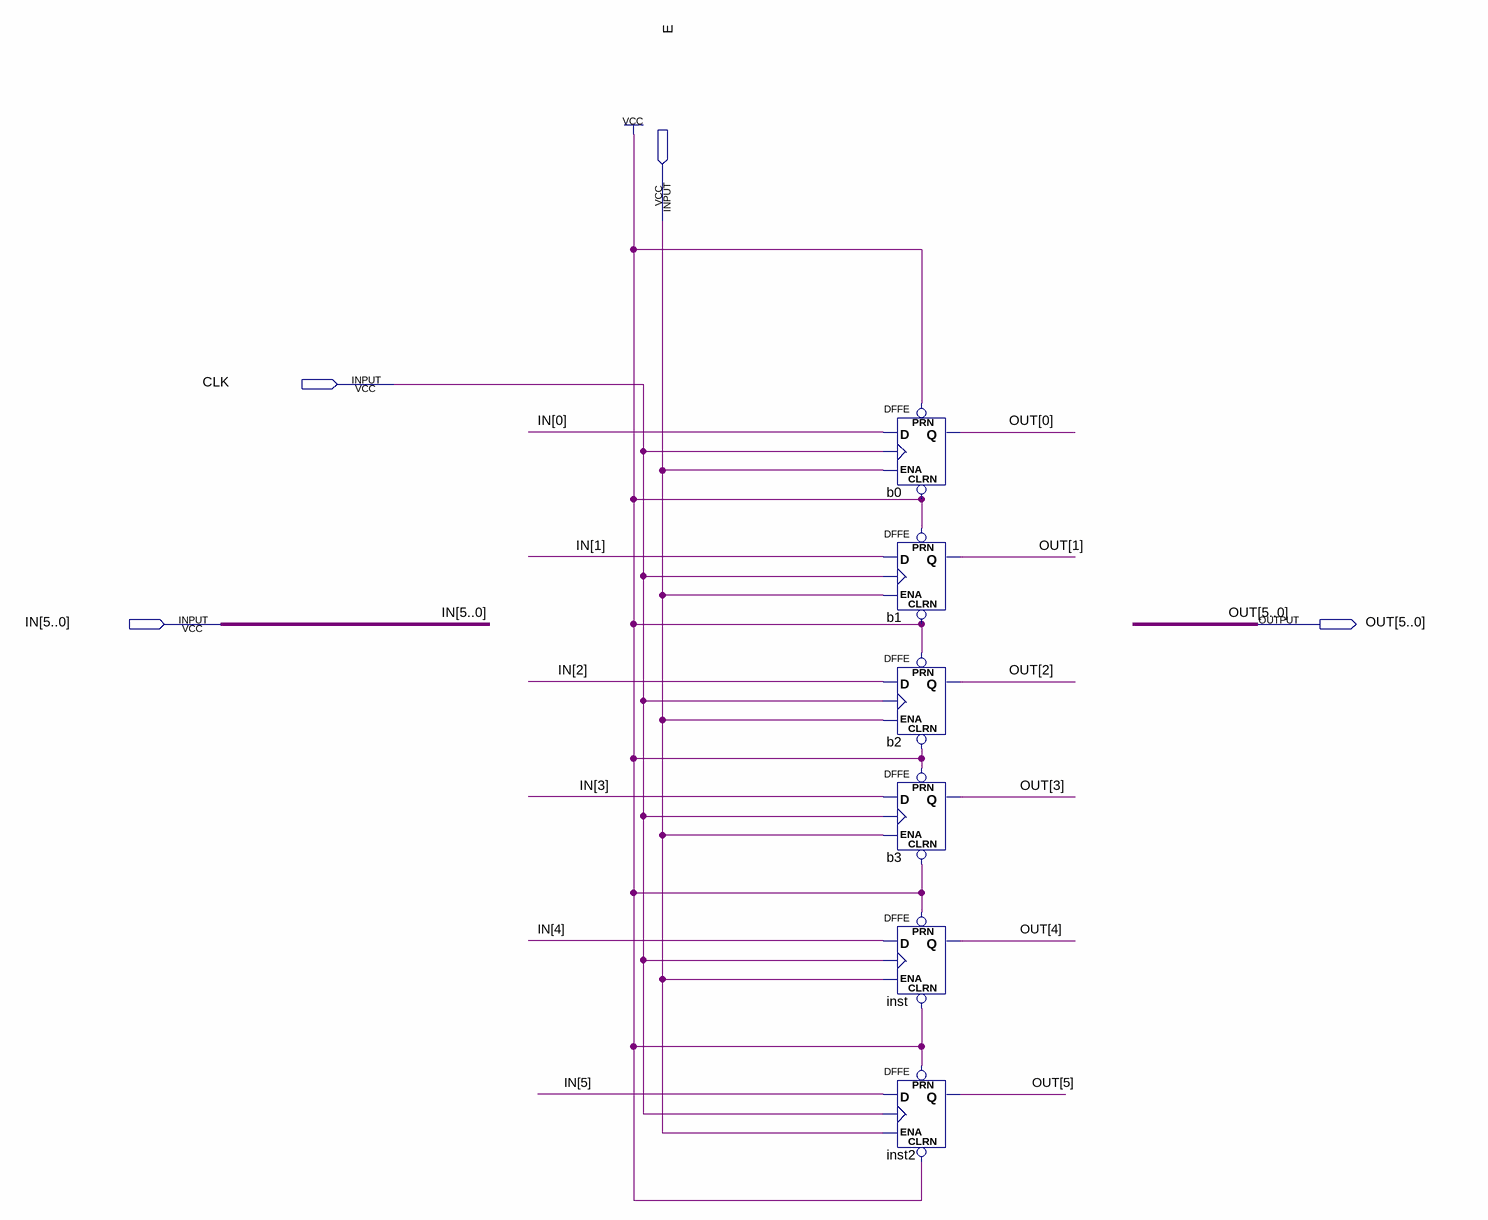
[diagram p0: schematic sheet]
// Quartus schematic reg6.bdf as structural Verilog: 6 symbols, 4 pins
module reg6 (
  input  E,
  input  CLK,
  input  [5:0] IN,
  output [5:0] OUT
);

  DFFE b0 (.PRN(1'b1), .CLRN(1'b1), .D(IN[0]), .CLK(CLK), .ENA(E), .Q(OUT[0]));
  DFFE b1 (.PRN(1'b1), .CLRN(1'b1), .D(IN[1]), .CLK(CLK), .ENA(E), .Q(OUT[1]));
  DFFE b2 (.PRN(1'b1), .CLRN(1'b1), .D(IN[2]), .CLK(CLK), .ENA(E), .Q(OUT[2]));
  DFFE b3 (.PRN(1'b1), .CLRN(1'b1), .D(IN[3]), .CLK(CLK), .ENA(E), .Q(OUT[3]));
  DFFE inst (.PRN(1'b1), .CLRN(1'b1), .D(IN[4]), .CLK(CLK), .ENA(E), .Q(OUT[4]));
  DFFE inst2 (.PRN(1'b1), .CLRN(1'b1), .D(IN[5]), .CLK(CLK), .ENA(E), .Q(OUT[5]));
endmodule
